# EAGLE design SHALightSwitch (EAGLE 6.5.0)
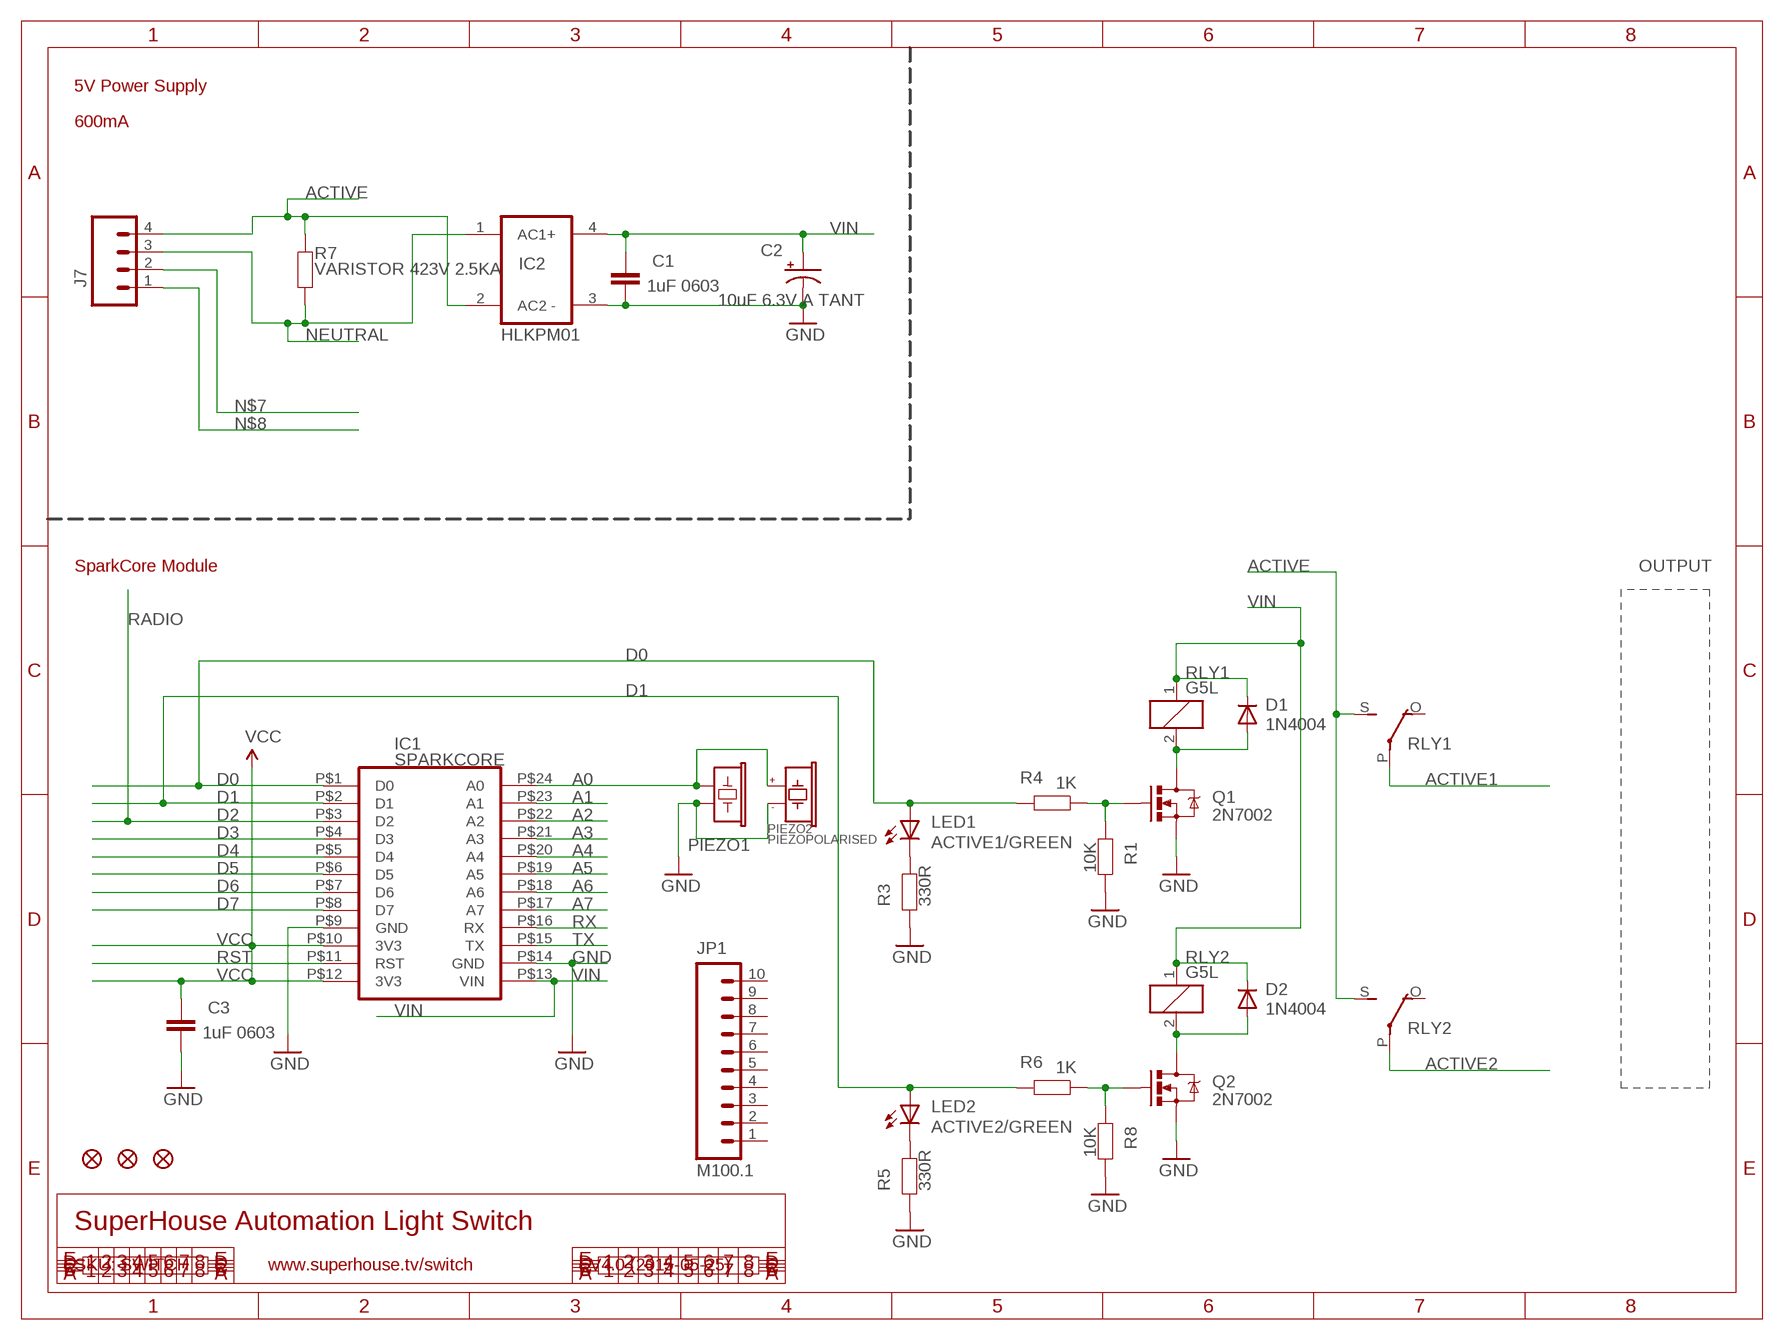
[diagram p0: schematic, sheet 1]

## Parts
C1  1uF 0603  CAP0603  [0603@1]
C2  10uF 6.3V A TANT  CAP_POL1206  [EIA3216]
C3  1uF 0603  CAP0603  [0603@1]
D1  1N4004  DIODESMB  [SMB-DIODE]
D2  1N4004  DIODESMB  [SMB-DIODE]
FID1  FIDUCIAL1X2.5  [FIDUCIAL-1X2.5]
FID2  FIDUCIAL1X2.5  [FIDUCIAL-1X2.5]
FID3  FIDUCIAL1X2.5  [FIDUCIAL-1X2.5]
IC1  SPARKCORE  [SPARKCORE]
IC2  HLKPM01  [HLKPM01]
J7  M04SCREW  [SCREWTERMINAL-3.5MM-4]
JP1  M100.1  [1X10]
LED1  ACTIVE1/GREEN  LED0603  [LED-0603]
LED2  ACTIVE2/GREEN  LED0603  [LED-0603]
PIEZO1  BUZZERSMD12X12  [BUZZER-12X12-SMT]
PIEZO2  PIEZOPOLARISED  [PIEZO12MMWIDEPOLARISED]
Q1  2N7002  MOSFET-NCHANNELSMD  [SOT23-3]
Q2  2N7002  MOSFET-NCHANNELSMD  [SOT23-3]
R1  10K  RESISTOR0603  [0603]
R3  330R  RESISTOR0603  [0603]
R4  1K  RESISTOR0603  [0603]
R5  330R  RESISTOR0603  [0603]
R6  1K  RESISTOR0603  [0603]
R7  VARISTOR 423V 2.5KA  RESISTORPTH1  [AXIAL-0.3]
R8  10K  RESISTOR0603  [0603]
RLY1  G5L  [G5LE]
RLY2  G5L  [G5LE]

## Nets
A0: IC1.P$24(A0) PIEZO1.1 PIEZO2.1(+)
A1: IC1.P$23(A1)
A2: IC1.P$22(A2)
A3: IC1.P$21(A3)
A4: IC1.P$20(A4)
A5: IC1.P$19(A5)
A6: IC1.P$18(A6)
A7: IC1.P$17(A7)
ACTIVE: IC2.2(AC2) J7.4 R7.P$2 RLY1.S(2:S) RLY2.S(2:S)
ACTIVE1: RLY1.P(2:P)
ACTIVE2: RLY2.P(2:P)
D0: IC1.P$1(D0) LED1.A R4.2
D1: IC1.P$2(D1) LED2.A R6.2
D2: IC1.P$3(D2)
D3: IC1.P$4(D3)
D4: IC1.P$5(D4)
D5: IC1.P$6(D5)
D6: IC1.P$7(D6)
D7: IC1.P$8(D7)
GND: C1.2 C2.C(-) C3.2 IC1.P$9(GND) IC1.P$14(GND) IC2.3(-) PIEZO1.2 PIEZO2.2(-) Q1.2(S) Q2.2(S) R1.2 R3.1 R5.1 R8.2
N$2: LED2.C R5.2
N$3: D2.A Q2.3(D) RLY2.2
N$4: D1.A Q1.3(D) RLY1.2
N$5: Q1.1(G) R1.1 R4.1
N$6: Q2.1(G) R6.1 R8.1
N$7: J7.2
N$8: J7.1
N$25: LED1.C R3.2
NEUTRAL: IC2.1(AC1) J7.3 R7.P$1
RST: IC1.P$11(RST)
RX: IC1.P$16(RX)
TX: IC1.P$15(TX)
VCC [VCC]: C3.1 IC1.P$10(3V3) IC1.P$12(3V3)
VIN: C1.1 C2.A(+) D1.C D2.C IC1.P$13(VIN) IC2.4(+) RLY1.1 RLY2.1
Unconnected: JP1.1 JP1.2 JP1.3 JP1.4 JP1.5 JP1.6 JP1.7 JP1.8 JP1.9 JP1.10 RLY1.O(2:O) RLY2.O(2:O)

## Notes on the sheet
- 5V Power Supply
- 600mA
- SparkCore Module | OUTPUT
- RADIO
- SuperHouse Automation Light Switch
- SKU: SWITCH | www.superhouse.tv/switch | V4.0 (2015-05-25)

## Library data of the parts
C1 C3 = freetronics:CAP: Capacitor Standard 0603 ceramic capacitor, and 0.1" leaded capacitor.
C2 = freetronics:CAP_POL: Capacitor Polarized These are standard SMD and PTH capacitors. Normally 10uF, 47uF, and 100uF in electrolytic and tantalum varieties. Always verify the external diameter of the through hole cap, it varies with capacity, voltage, and manufacturer. The EIA devices should be standard.
D1 D2 = freetronics-master-v1.1:DIODE: Diode These are standard reverse protection diodes and small signal diodes. SMA package can handle up to about 1A. SOD-323 can handle about 200mA. What the SOD-323 package when ordering, there are some mfgs out there that are 5-pin packages.
FID1-FID3 = freetronics:FIDUCIAL: Fiducial Alignment Points Various fiducial points for machine vision alignment.
IC1 = freetronics-jon:SPARKCORE
IC2 = freetronics-jon:HLKPM01
J7 = freetronics-master-v1.1:M04: Header 4 Standard 4-pin 0.1" header. Use with straight break away headers (SKU : PRT-00116), right angle break away headers (PRT-00553), swiss pins (PRT-00743), machine pins (PRT-00117), and female headers (PRT-00115). Molex polarized connector foot print use with SKU : PRT-08231 with associated crimp pins and housings.
JP1 = freetronics-original:M10: Header 10 Standard 10-pin 0.1" header. Use with straight break away headers (SKU : PRT-00116), right angle break away headers (PRT-00553), swiss pins (PRT-00743), machine pins (PRT-00117), and female headers (PRT-00115).
LED1 LED2 = freetronics:LED: LEDs Standard schematic elements and footprints for 5mm, 3mm, 1206, and 0603 sized LEDs. 5mm - Spark Fun Electronics SKU : COM-00529 (and others)
PIEZO1 = freetronics-master-v1:BUZZER: Buzzer - Piezo Transducer
PIEZO2 = freetronics-jon:PIEZOPOLARISED
Q1 Q2 = freetronics-master-v1:MOSFET-NCHANNEL
R1 R3-R6 R8 = freetronics:RESISTOR: Resistor Basic schematic elements and footprints for 0603, 1206, and PTH 1/10th watt (small) resistors.
R7 = freetronics-master-v1.1:RESISTOR: Resistor Basic schematic elements and footprints for 0603, 1206, and PTH 1/10th watt (small) resistors.
RLY1 RLY2 = relay:G5L: RELAY 1 x switch, 10 A/120 V AC, 8 A/30 V ADC, Omron; OC_FARNELL: unknown; OC_NEWARK: unknown

## Net classes
0 Default: width 0.203 mm
1 VCC: width 0.305 mm

## Board
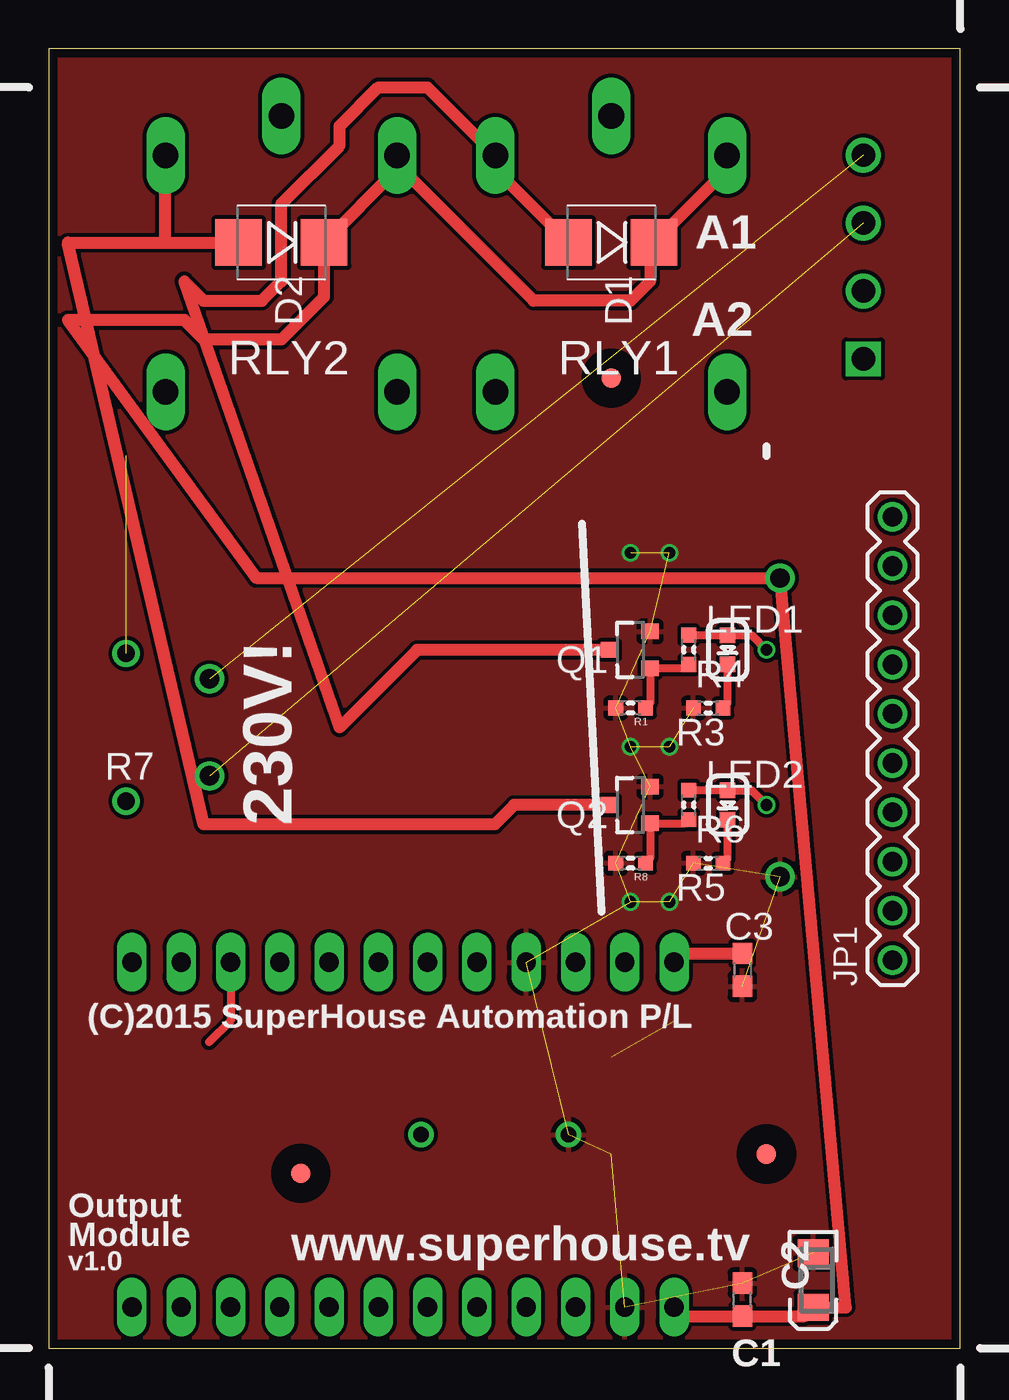
[diagram p1: board, top side]
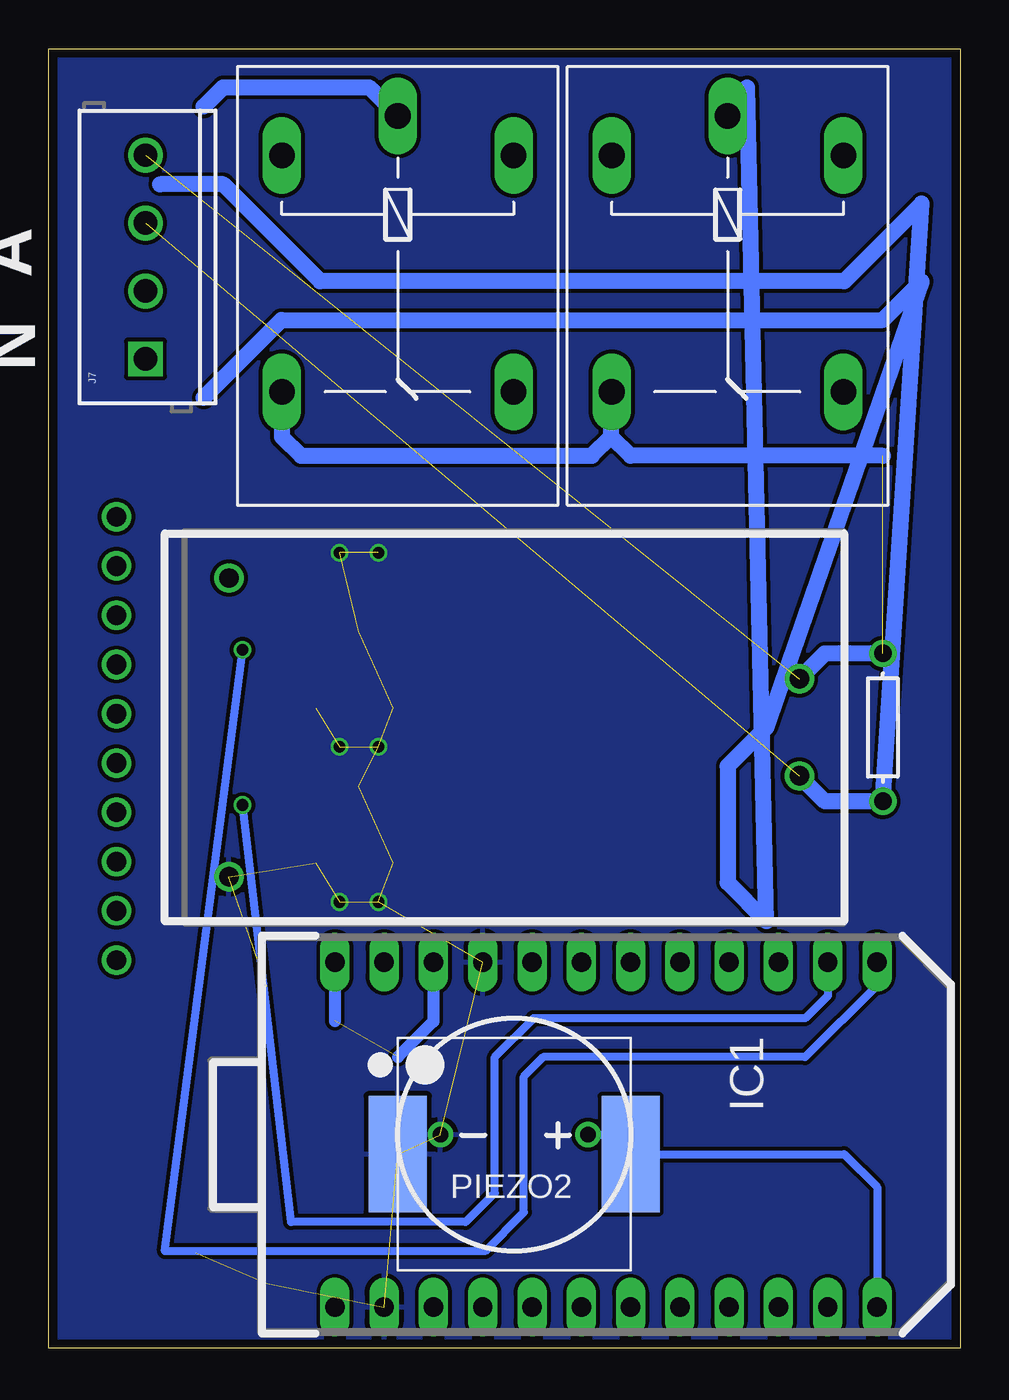
[diagram p2: board, bottom side, seen from below]

Size 47 x 67 mm. Coordinates in mm from the lower left corner, seen from the top.
Outline: 0,0 47,0 47,67 0,67 0,0
Copper layers (1*16): Top 0.035mm / dielectric 1.5mm / Bottom 0.035mm
Design rules "default": minimum track width 8mil, minimum drill 15mil, track to track 8mil, track to pad 8mil, pad to pad 8mil, via to via 8mil, smd to smd 8mil, copper to edge 18mil, drill to drill 8mil, minimum pad ring 10mil, minimum via ring 6mil, stop-mask expansion 4mil, vias tented up to drill 25mil, thermal gap 10mil
tRestrict: area 28,49 to 30,51; area 12,8 to 14,10; area 36,9 to 38,11

### Footprints (pad centres in the part's own frame; a part is rotated, then mirrored left to right if it is on the bottom)
0603@1 = smd 1.1 x 1: 1 -0.85,0; 2 0.85,0
EIA3216 = smd 1.4 x 1.6: A 1.4,0; C -1.4,0
SMB-DIODE = smd 2.4 x 2.4: A 2.2,0; C -2.2,0
FIDUCIAL-1X2.5 = smd 1 x 1: 1 0,0
SPARKCORE = drill 1 long: P$1 -8.89,12.7; P$2 -8.89,10.16; P$3 -8.89,7.62; P$4 -8.89,5.08; P$5 -8.89,2.54; P$6 -8.89,0; P$7 -8.89,-2.54; P$8 -8.89,-5.08; P$9 -8.89,-7.62; P$10 -8.89,-10.16; P$11 -8.89,-12.7; P$12 -8.89,-15.24; P$13 8.89,-15.24; P$14 8.89,-12.7; P$15 8.89,-10.16; P$16 8.89,-7.62; P$17 8.89,-5.08; P$18 8.89,-2.54; P$19 8.89,0; P$20 8.89,2.54; P$21 8.89,5.08; P$22 8.89,7.62; P$23 8.89,10.16; P$24 8.89,12.7
HLKPM01 = drill 1: 1 -14.7,2.5; 2 -14.7,-2.5; 3 14.7,7.7; 4 14.7,-7.7
SCREWTERMINAL-3.5MM-4 = drill 1.2 square: 1 0,0 | drill 1.2: 2 3.5,0; 3 7,0; 4 10.5,0
1X10 = drill 1.016: 1 0,0; 2 2.54,0; 3 5.08,0; 4 7.62,0; 5 10.16,0; 6 12.7,0; 7 15.24,0; 8 17.78,0; 9 20.32,0; 10 22.86,0
LED-0603 = smd 0.8 x 0.8: A 0,-0.75; C 0,0.75
BUZZER-12X12-SMT = smd 3 x 6: 1 -6,0; 2 6,0
PIEZO12MMWIDEPOLARISED = drill 0.8: 1 -3.8,0; 2 3.8,0
SOT23-3 = smd 0.8 x 0.9: 1 -0.95,-1; 2 0.95,-1; 3 0,1.1
0603 = smd 0.762 x 0.762: 1 -0.762,0; 2 0.762,0
AXIAL-0.3 = drill 0.9: P$1 -3.81,0; P$2 3.81,0
G5LE = drill 1.321 long: 1 -7.493,-5.969; 2 -7.493,5.969; O 4.699,5.969; P -9.525,0; S 4.699,-5.969

### Placement (x,y rotation side)
C1  35.76,2.5 90 top
C2  39.41,3.5 270 top
C3  35.76,19.5 270 top
D1  29,57 180 top
D2  12,57 180 top
FID1  29,50 0 top
FID2  13,9 0 top
FID3  37,10 0 top
IC1  17,11 270 bottom
IC2  23,32 180 bottom
J7  42,51 90 bottom
JP1  43.5,20 90 top
LED1  35,36 180 top
LED2  35,28 180 top
PIEZO1  23,10 180 bottom
PIEZO2  23,11 180 bottom
Q1  30,36 90 top
Q2  30,28 90 top
R1  30,33 180 top
R3  34,33 0 top
R4  33,36 90 top
R5  34,25 0 top
R6  33,28 90 top
R7  4,32 90 bottom
R8  30,25 180 top
RLY1  29,54 270 bottom
RLY2  12,54 270 bottom

### Tracks (layer width: path | path; a pad name or v marks a point on that pad's centre or on a via)
A0
  Bottom 0.406: IC1.P$24 4.3,8.3 6,10 PIEZO1.1 17.5,11 PIEZO2.1
ACTIVE  (2 unrouted)
  Bottom 0.813: RLY1.S 34.97,46.97 34,46 19,46 18,47 | 18,47 18,49.27 RLY2.S | 4,46 17,46 18,47 | R7.P$2 6.99,35.81 IC2.2
ACTIVE1
  Bottom 0.813: 39,64 38,65 30.48,65 RLY1.P
ACTIVE2
  Bottom 0.813: 39,49 35,53 4,53 2,55 10,32 12,30 12,24 10,22 11,65 12,64 RLY2.P
D0  (via drill 0.6)
  Top 0.406: R4.2 34.99,36.76 LED1.A 36.25,36.75 v37,36
  Bottom 0.406: IC1.P$1 4.3,18.7 8,15 21.5,15 22.5,14 22.5,7 24.5,5 41,5 v37,36
D1  (via drill 0.6)
  Top 0.406: R6.2 34.99,28.76 LED2.A 36.25,28.75 v37,28
  Bottom 0.406: IC1.P$2 6.84,18.16 8,17 22,17 24,15 24,8 25.5,6.5 34.5,6.5 v37,28
D2
  Top 0.406: IC1.P$3 9.38,16.88 8.26,15.76
GND  (via drill 0.6)  (19 unrouted)
  other vias: 30,31 32,31 32,23 30,23 30,41 32,41
  pour Bottom: 0,67 46.96,67 46.96,0 0,0
  pour Top: 0,67 46.96,67 46.96,0 0,0
N$2
  Top 0.406: R5.2 35,25.24 LED2.C
N$3
  Top 0.406: RLY2.2 6,61.49 6,61.46
  Top 0.61: Q2.3 24,28 23,27 8,27 1,57 6,57 | 6,57 D2.A | 6,61.46 6,57
N$4
  Top 0.61: Q1.3 19,36 15,32 7,55 8,54 11,54 12,55 12,59 15,62 15,63 17,65 19.52,65 RLY1.2 23.03,60.77 D1.A
N$5
  Top 0.406: R4.1 32.81,35.05 Q1.1 31,33.24 R1.1
N$6
  Top 0.406: R6.1 32.81,27.05 Q2.1 31,25.24 R8.1
N$25
  Top 0.406: R3.2 35,33.24 LED1.C
NEUTRAL  (1 unrouted)
  Bottom 0.813: 41.25,60 38,60 33,55 6,55 2,59 R7.P$1 6.99,28.19 IC2.1
VCC  (1 unrouted)
  Top 0.61: IC1.P$12 32.7,20.35 C3.1
  Bottom 0.61: IC1.P$12 32.24,16.86 | IC1.P$10 27.16,16.84 29,15
VIN
  Top 0.61: RLY1.1 34.97,60.77 D1.C 31,56.8 31,55 30,54 25,54 17.97,61.03 RLY2.1 17.97,60.77 D2.C 14.2,54.2 12,52 8,52 7,53 1,53 10.7,39.7 IC2.4 41.1,2.1 C2.A 38.96,1.65 C1.1 32.7,1.65 IC1.P$13

### Text on the board
tPlace: A1 | A2 | 230V! | (C)2015 SuperHouse Automation P/L | Output | Module | v1.0 | www.superhouse.tv
bPlace: A | N
tDocu: 2 x 330R 0603 / 3 x 1K 0603 / 2 x 10K 0603 / 2 x 1N4004 SMA / 2 x 1uF 0603 / 1 x 10uF 6.3V TANT / 2 x 2N7002 / 2 x GREEN LED